# Altium schematic sheet EBAZ4205扩展_RGB_RX.SchDoc
size A4; DocumentNumber: 3; SheetNumber: 2; SheetTotal: 4
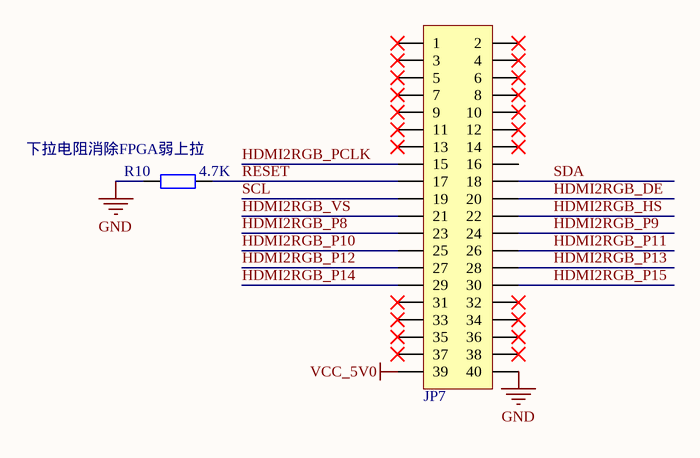
[diagram p0: EBAZ4205扩展_RGB_RX.SchDoc]

## Parts
JP7  Header 2X11  [PHD2.0-LI-2x20P]  (value not drawn)
R10  4.7K  [R0402_L]

## Nets
GND: JP7.40 R10.1
VCC_5V0: JP7.39
HDMI2RGB_DE: JP7.20
HDMI2RGB_HS: JP7.22
HDMI2RGB_P8: JP7.23
HDMI2RGB_P9: JP7.24
HDMI2RGB_P10: JP7.25
HDMI2RGB_P11: JP7.26
HDMI2RGB_P12: JP7.27
HDMI2RGB_P13: JP7.28
HDMI2RGB_P14: JP7.29
HDMI2RGB_P15: JP7.30
HDMI2RGB_PCLK: JP7.15
HDMI2RGB_VS: JP7.21
RESET: JP7.17 R10.2
SCL: JP7.19
SDA: JP7.18

Not connected (* = marked no-connect by the designer): JP7 1* 2* 3* 4* 5* 6* 7* 8* 9* 10* 11* 12* 13* 14* 16 31* 32* 33* 34* 35* 36* 37* 38*

## Notes on the sheet
- (near R10) 下拉电阻消除FPGA弱上拉

## Library data of the parts
JP7 = Header 20X2: 20*2P接插件; 封装库来自淘宝卖家 ID：黄晶宝石: 其他店铺购入均为盗版假冒封装库; BOM名称: 20*2P接插件
R10 = R: 贴片电阻; 3.交流分享: Q群514746572,开源更新,欢迎一起交流学习PCB设计; 4.作者声明: 旨为整合最全库集,欢迎转载,禁止商用！-冰凌猫; 5.备注说明: 该库已二次整合过网上各热销库,基本最全,无需重复搜购安装; 1.库作者: 冰凌猫; 2.库版本: v2.0 (2021.03.30); 0.0_BOM名称: 贴片电阻